# EasyEDA schematic IPG_Sensor_V2.json
TITLE: Sheet_1; REV: 1.0; Date: 2020-03-26; Sheet: 1/1; Drawn By: Wells_D; Company: Your Company
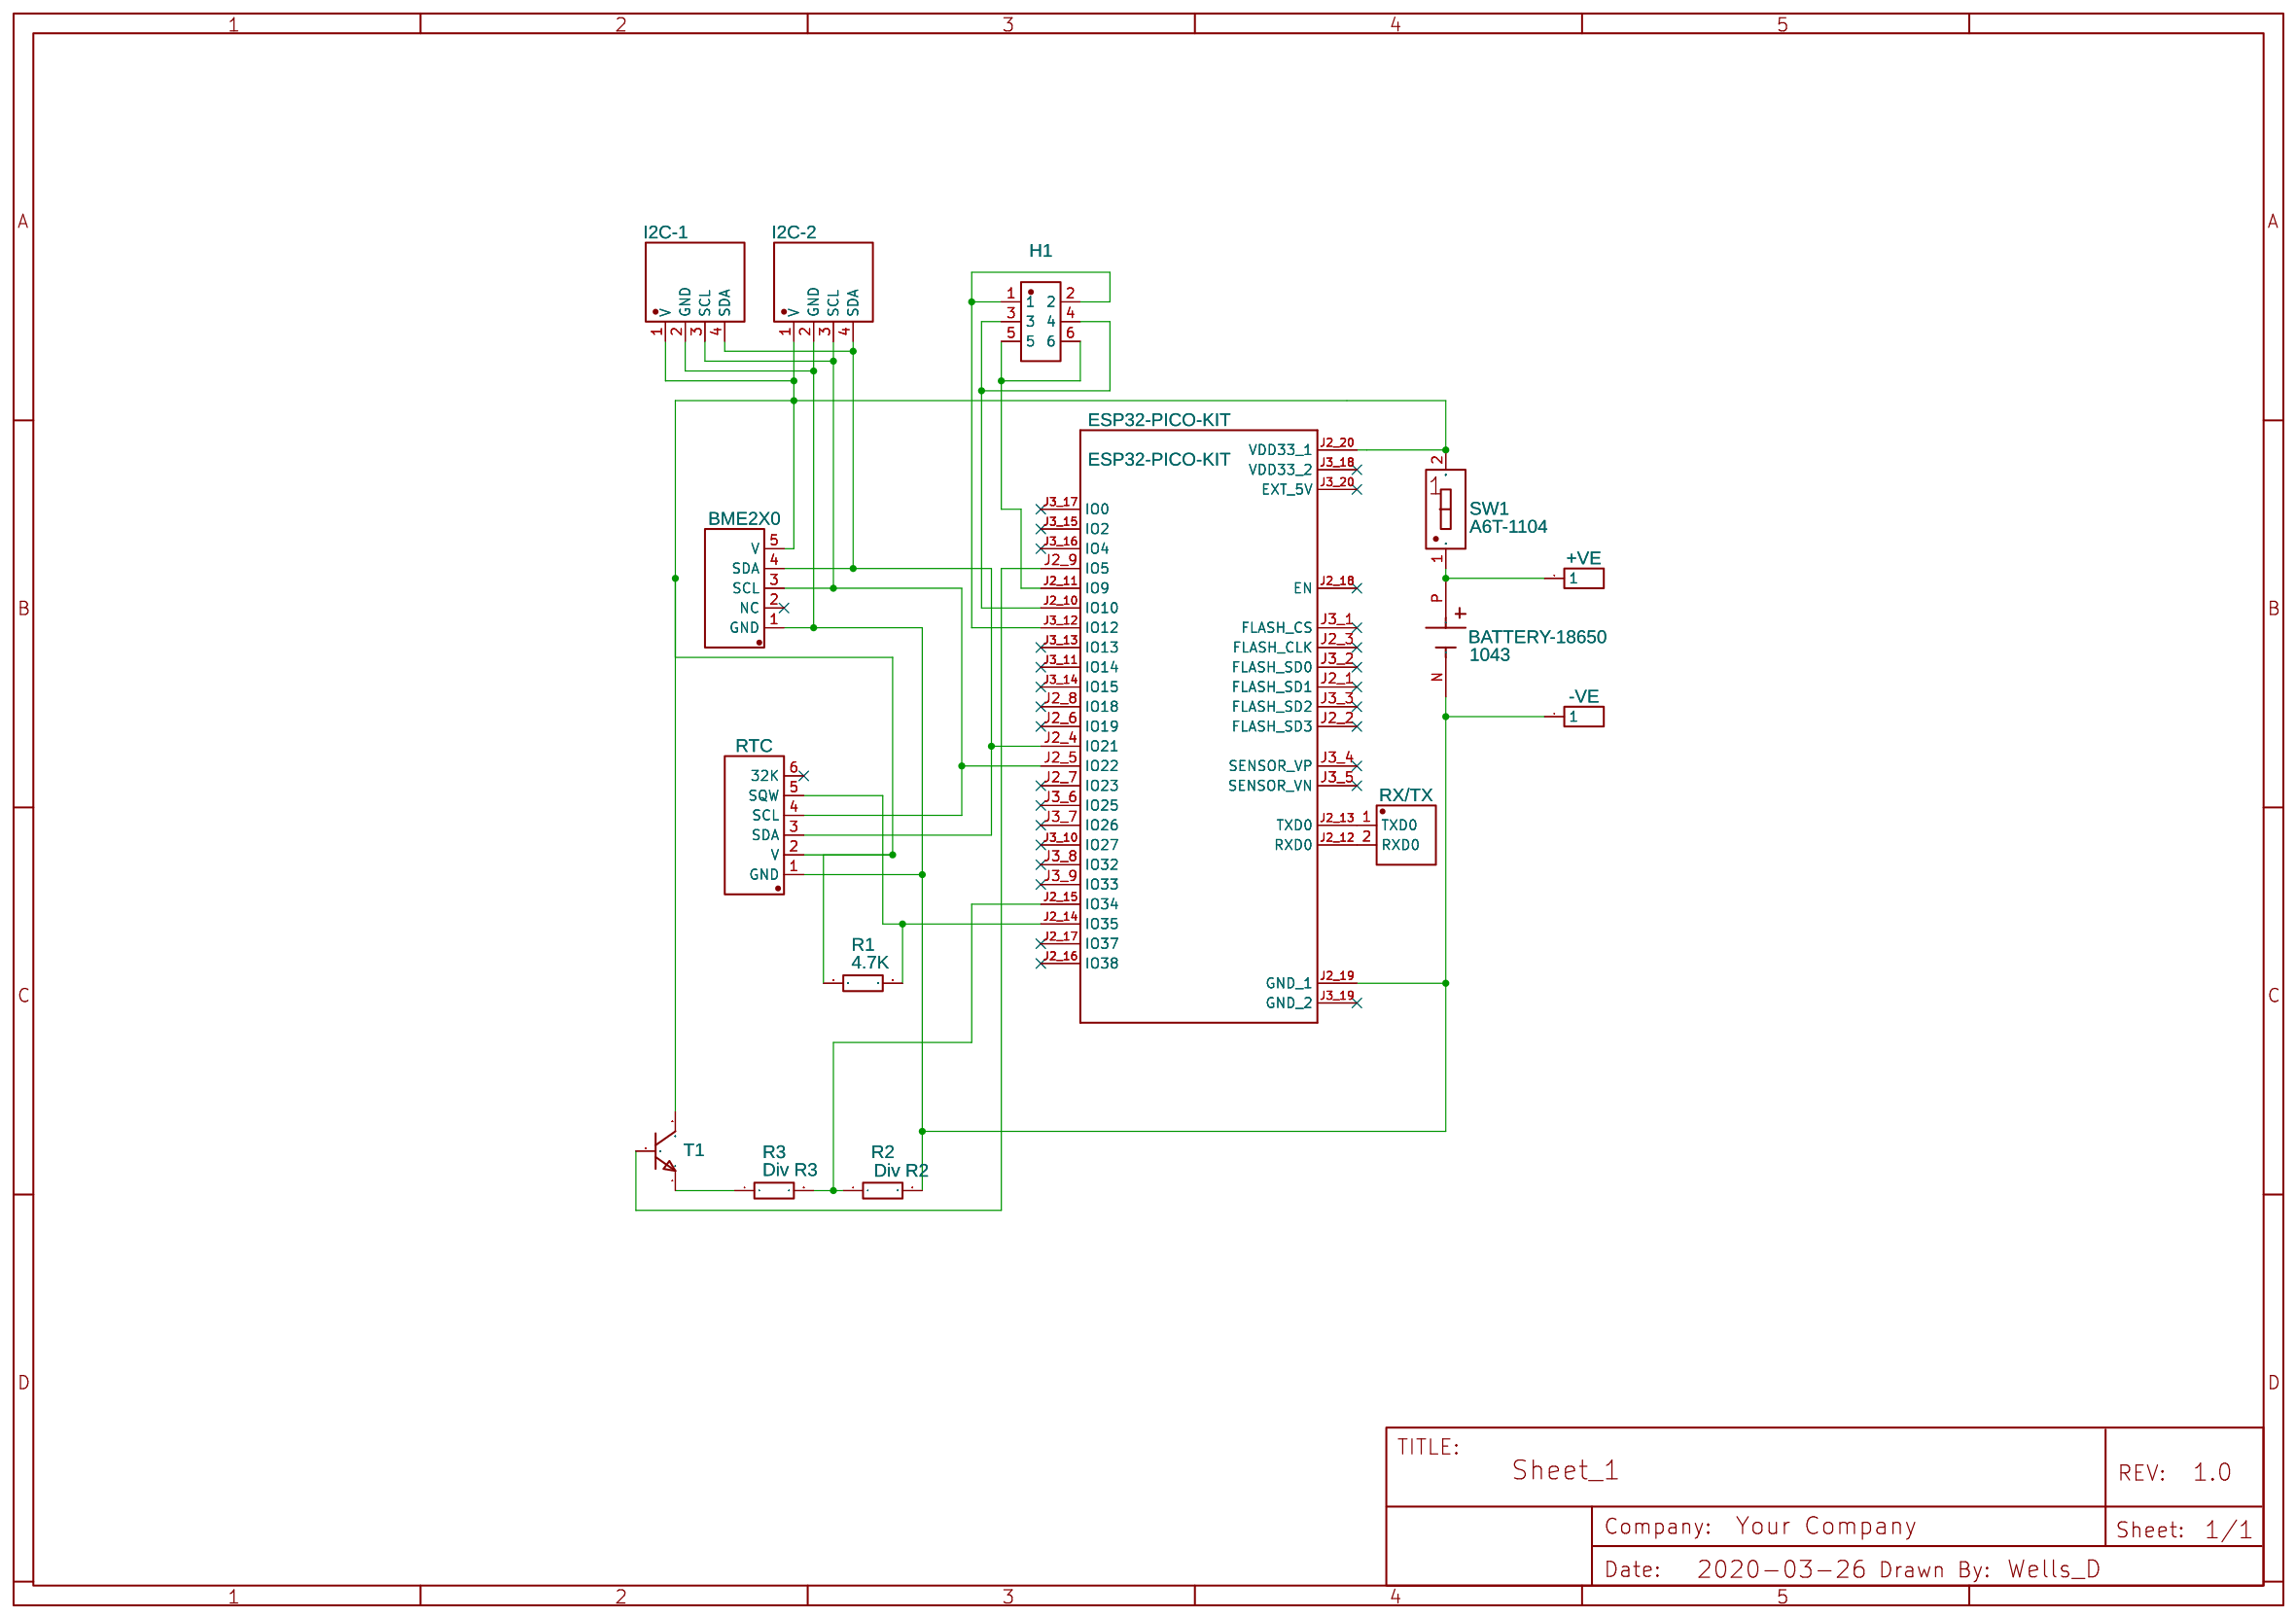
[diagram p0: schematic sheet]

## Parts
+VE  Header-Male-2.54_1x1  [HDR-TH_1P-P2.54-V-M]
-VE  Header-Male-2.54_1x1  [HDR-TH_1P-P2.54-V-M]
BATTERY-18650  1043  [BAT_1043]
BME2X0  2685Y-105CNG1SNA01  [HDR-TH_5P-P2.54-V]
ESP32-PICO-KIT  ESP32-PICO-KIT  [XCVR_ESP32-PICO-KIT]
H1  67997-206HLF  [HDR-TH_6P-P2.54-V-R2-C3-S2.54]
I2C-1  1  [HDR-TH_4P-P2.54-V_RE-H042TD-1190]
I2C-2  2  [HDR-TH_4P-P2.54-V_RE-H042TD-1190]
R1  4.7K  [RES-TH_BD3.3-L9.0-P13.00-D0.6]
R2  Div R2  [RES-TH_BD3.3-L9.0-P13.00-D0.6]
R3  Div R3  [RES-TH_BD3.3-L9.0-P13.00-D0.6]
RTC  68000-406HLF  [HDR-TH_6P-P2.54-V]
RX/TX  RE-H022TD-1190 (LF)(SN)  [HDR-TH_2P-P2.54-V]
SW1  A6T-1104  [SW-TH_2P-L3.9-W9.9-P2.54-LS7.6]
T1  2N2222  [TO-92-3_L4.9-W3.7-P1.27-L]

## Library data of the parts
+VE -VE = Header-Male-2.54_1x1: Supplier: LCSC; Manufacturer: ReliaPro; Supplier Part: C81276
BATTERY-18650 = 1043: Contributor: Wells_D
BME2X0 = 2685Y-105CNG1SNA01: Supplier: LCSC; Supplier Part: C350302; Manufacturer: 华宇创; Contributor: LCSC
ESP32-PICO-KIT = ESP32-PICO-KIT: Contributor: Wells_D
H1 = 67997-206HLF: Supplier: LCSC; Supplier Part: C236051; Manufacturer: Amphenol ICC; Contributor: LCSC
I2C-1 I2C-2 = RE-H042TD-1190 (LF)(SN): Supplier: LCSC; Supplier Part: C160334; Manufacturer: JST Sales America; Contributor: LCSC
R1-R3 = RN1/2W4.7KΩFT/BA1: Supplier: LCSC; Supplier Part: C385631; Manufacturer: TyoHM; Contributor: LCSC
RTC = 68000-406HLF: Supplier: LCSC; Supplier Part: C178289; Manufacturer: Amphenol ICC; Contributor: LCSC
RX/TX = RE-H022TD-1190 (LF)(SN): Supplier: LCSC; Supplier Part: C160332; Manufacturer: JST Sales America; Contributor: LCSC
SW1 = A6T-1104: Supplier: LCSC; Supplier Part: C306874; Manufacturer: Omron Electronics; Contributor: LCSC
T1 = 2N2222: Supplier: LCSC; Manufacturer: SEMTECH; Contributor: LCSC; Supplier Part: C118536

## Nets
Net-(+VE-1): +VE.1 BATTERY-18650.P SW1.1(PIN1)
Net-(-VE-1): -VE.1 BATTERY-18650.N BME2X0.1(GND) ESP32-PICO-KIT.J2_19(GND_1) I2C-1.2(GND) I2C-2.2(GND) R2.2 RTC.1(GND)
Net-(BME2X0-3): BME2X0.3(SCL) ESP32-PICO-KIT.J2_5(IO22) I2C-1.3(SCL) I2C-2.3(SCL) RTC.4(SCL)
Net-(BME2X0-4): BME2X0.4(SDA) ESP32-PICO-KIT.J2_4(IO21) I2C-1.4(SDA) I2C-2.4(SDA) RTC.3(SDA)
Net-(BME2X0-5): BME2X0.5(V) ESP32-PICO-KIT.J2_20(VDD33_1) I2C-1.1(V) I2C-2.1(V) R1.1 RTC.2(V) SW1.2(PIN2) T1.3(C)
Net-(ESP32-PICO-KIT-J2_9): ESP32-PICO-KIT.J2_9(IO5) T1.2(B)
Net-(ESP32-PICO-KIT-J2_10): ESP32-PICO-KIT.J2_10(IO10) H1.3 H1.4
Net-(ESP32-PICO-KIT-J2_11): ESP32-PICO-KIT.J2_11(IO9) H1.5 H1.6
Net-(ESP32-PICO-KIT-J2_12): ESP32-PICO-KIT.J2_12(RXD0) RX/TX.2(RXD0)
Net-(ESP32-PICO-KIT-J2_13): ESP32-PICO-KIT.J2_13(TXD0) RX/TX.1(TXD0)
Net-(ESP32-PICO-KIT-J2_14): ESP32-PICO-KIT.J2_14(IO35) R1.2 RTC.5(SQW)
Net-(ESP32-PICO-KIT-J2_15): ESP32-PICO-KIT.J2_15(IO34) R2.1 R3.2
Net-(ESP32-PICO-KIT-J3_12): ESP32-PICO-KIT.J3_12(IO12) H1.1 H1.2
Net-(R3-1): R3.1 T1.1(E)

Not connected (* = marked no-connect by the designer): BME2X0 2(NC)*; ESP32-PICO-KIT J2_1(FLASH_SD1)* J2_2(FLASH_SD3)* J2_3(FLASH_CLK)* J2_6(IO19)* J2_7(IO23)* J2_8(IO18)* J2_16(IO38)* J2_17(IO37)* J2_18(EN)* J3_1(FLASH_CS)* J3_2(FLASH_SD0)* J3_3(FLASH_SD2)* J3_4(SENSOR_VP)* J3_5(SENSOR_VN)* J3_6(IO25)* J3_7(IO26)* J3_8(IO32)* J3_9(IO33)* J3_10(IO27)* J3_11(IO14)* J3_13(IO13)* J3_14(IO15)* J3_15(IO2)* J3_16(IO4)* J3_17(IO0)* J3_18(VDD33_2)* J3_19(GND_2)* J3_20(EXT_5V)*; RTC 6(32K)*
